# Altium project flyingpi.PrjPcb
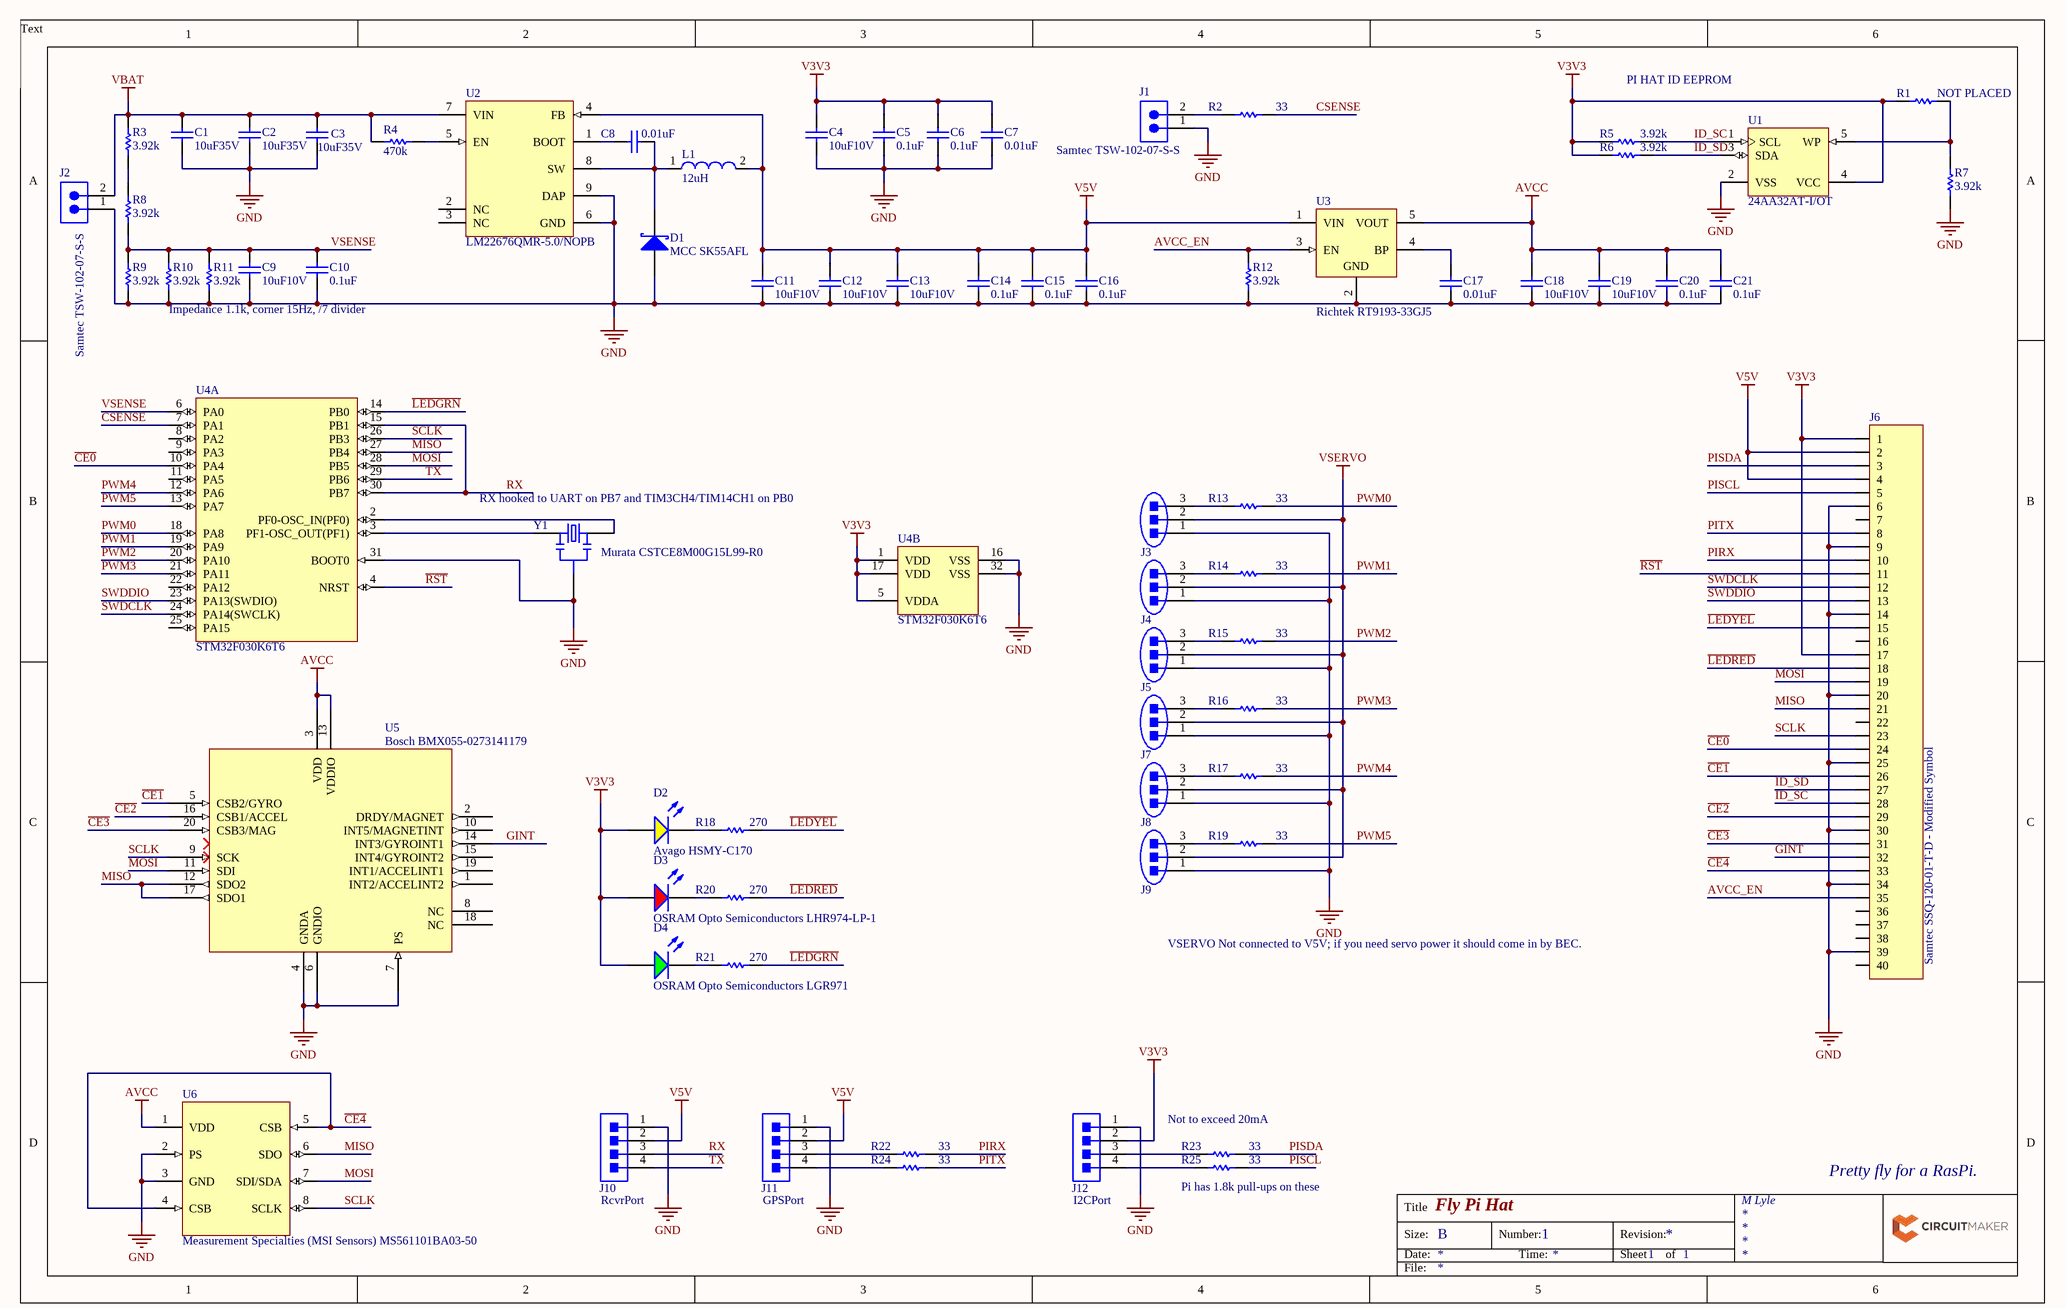
[diagram p0: flyingpi.SchDoc]
1 sheet, 70 parts. Net scope: global (net labels, ports and power ports of the same name join across sheets).

## Sheet flyingpi.SchDoc: Fly Pi Hat
size B; CompanyName: M Lyle; DrawnBy: M Lyle; Engineer: M Lyle; Organization: M Lyle; DocumentNumber: 1; SheetNumber: 1; SheetTotal: 1; PageSetup: Record=PageOptions|CenterHorizontal=True|CenterVertical=True|PrintScale=1.10|XCorrection=1.00|YCorrection=1.00|PrintKind=1|BorderSize=5000000|LeftOffset=0|BottomOffset=0|Orientation=2|PaperLength=4318|PaperWidth=2794|Scale=100|PaperSource=7|PrintQuality=-3|MediaType=1|DitherType=10|PrintScaleMode=1|PaperKind=US B (11 x 17 in)|PaperIndex=262

### Parts
C1  10uF35V  [PCB-4097432-1]
C2  10uF35V  [PCB-4097432-1]
C3  10uF35V  [PCB-4097432-1]
C4  10uF10V  [PCB-11286000-1]
C5  0.1uF  [CAPC1608X90X35LL10T15]
C6  0.1uF  [CAPC1608X90X35LL10T15]
C7  0.01uF  [0603C]
C8  0.01uF  [0603C]
C9  10uF10V  [PCB-11286000-1]
C10  0.1uF  [CAPC1608X90X35LL10T15]
C11  10uF10V  [PCB-11286000-1]
C12  10uF10V  [PCB-11286000-1]
C13  10uF10V  [PCB-11286000-1]
C14  0.1uF  [CAPC1608X90X35LL10T15]
C15  0.1uF  [CAPC1608X90X35LL10T15]
C16  0.1uF  [CAPC1608X90X35LL10T15]
C17  0.01uF  [0603C]
C18  10uF10V  [PCB-11286000-1]
C19  10uF10V  [PCB-11286000-1]
C20  0.1uF  [CAPC1608X90X35LL10T15]
C21  0.1uF  [CAPC1608X90X35LL10T15]
D1  MCC SK55AFL  [SODFL500X120-2N]
D2  Avago HSMY-C170  [SMD_LED0805]
D3  OSRAM Opto Semiconductors LHR974-LP-1  [LED0805]
D4  OSRAM Opto Semiconductors LGR971  [LED0805]
J1  Samtec TSW-102-07-S-S  [HDR102]
J2  Samtec TSW-102-07-S-S  [HDR102]
J3  TE Connectivity (Tyco Electronics) 5-146280-3  [HDR1x3_100mil]  (value not drawn)
J4  TE Connectivity (Tyco Electronics) 5-146280-3  [HDR1x3_100mil]  (value not drawn)
J5  TE Connectivity (Tyco Electronics) 5-146280-3  [HDR1x3_100mil]  (value not drawn)
J6  Samtec SSQ-120-01-T-D - Modified Symbol  [PCB-677180-1]
J7  TE Connectivity (Tyco Electronics) 5-146280-3  [HDR1x3_100mil]  (value not drawn)
J8  TE Connectivity (Tyco Electronics) 5-146280-3  [HDR1x3_100mil]  (value not drawn)
J9  TE Connectivity (Tyco Electronics) 5-146280-3  [HDR1x3_100mil]  (value not drawn)
J10  TE Connectivity (Tyco Electronics) 3-644456-4  [PCB-640283-1]  (value not drawn)
J11  TE Connectivity (Tyco Electronics) 3-644456-4  [PCB-640283-1]  (value not drawn)
J12  TE Connectivity (Tyco Electronics) 3-644456-4  [PCB-640283-1]  (value not drawn)
L1  12uH  [WE-PD-L]
R1  NOT PLACED  [RESC1609X50X30LL10T20]
R2  33  [RESC1609X50X30LL10T20]
R3  3.92k  [RESC1609X50X30LL10T20]
R4  470k  [RESC1608X55X30LL15T15]
R5  3.92k  [RESC1609X50X30LL10T20]
R6  3.92k  [RESC1609X50X30LL10T20]
R7  3.92k  [RESC1609X50X30LL10T20]
R8  3.92k  [RESC1609X50X30LL10T20]
R9  3.92k  [RESC1609X50X30LL10T20]
R10  3.92k  [RESC1609X50X30LL10T20]
R11  3.92k  [RESC1609X50X30LL10T20]
R12  3.92k  [RESC1609X50X30LL10T20]
R13  33  [RESC1609X50X30LL10T20]
R14  33  [RESC1609X50X30LL10T20]
R15  33  [RESC1609X50X30LL10T20]
R16  33  [RESC1609X50X30LL10T20]
R17  33  [RESC1609X50X30LL10T20]
R18  270  [RESC1609X50X30LL10T20]
R19  33  [RESC1609X50X30LL10T20]
R20  270  [RESC1609X50X30LL10T20]
R21  270  [RESC1609X50X30LL10T20]
R22  33  [RESC1609X50X30LL10T20]
R23  33  [RESC1609X50X30LL10T20]
R24  33  [RESC1609X50X30LL10T20]
R25  33  [RESC1609X50X30LL10T20]
U1  24AA32AT-I/OT  [SOT-23-OT5_L]
U2  LM22676QMR-5.0/NOPB  [MRA08B_M]
U3  Richtek RT9193-33GJ5  [PCB-1508243-1]
U4  STM32F030K6T6  [STM-LQFP32_N]  (parts A,B of 2)
U5  Bosch BMX055-0273141179  [LGA20]
U6  Measurement Specialties (MSI Sensors) MS561101BA03-50  [PCB-13001525-1]
Y1  Murata CSTCE8M00G15L99-R0  [X3-SMD-3.6X1.3X0.8MM]

### Nets
AVCC: C18.2 C19.2 C20.2 C21.2 U3.5(VOUT) U5.3(VDD) U5.13(VDDIO) U6.1(VDD)
GND: C1.1 C2.1 C3.1 C4.1 C5.1 C6.1 C7.1 C9.1 C10.1 C11.1 C12.1 C13.1 C14.1 C15.1 C16.1 C17.1 C18.1 C19.1 C20.1 C21.1 D1.1(A) J1.1 J2.1 J3.1 J4.1 J5.1 J6.6 J6.9 J6.14 J6.20 J6.25 J6.30 J6.34 J6.39 J7.1 J8.1 J9.1 J10.1 J11.1 J12.1 R7.2 R9.1 R10.1 R11.1 R12.2 U1.2(VSS) U2.6(GND) U2.9(DAP) U3.2(GND) U4.16(VSS) U4.31(BOOT0) U4.32(VSS) U5.4(GNDA) U5.6(GNDIO) U5.7(PS) U6.2(PS) U6.3(GND) Y1.2
V3V3: C4.2 C5.2 C6.2 C7.2 D2.2(A) D3.2(A) D4.2(A) J6.1 J6.17 J12.2 R1.1 R5.2 R6.2 U1.4(VCC) U4.1(VDD) U4.5(VDDA) U4.17(VDD)
V5V: C11.2 C12.2 C13.2 C14.2 C15.2 C16.2 J6.2 J6.4 J10.2 J11.2 L1.2 U2.4(FB) U3.1(VIN)
VBAT: C1.2 C2.2 C3.2 J2.2 R3.2 R4.1 U2.7(VIN)
VSERVO: J3.2 J4.2 J5.2 J7.2 J8.2 J9.2
AVCC_EN: J6.35 R12.1 U3.3(EN)
~{CE0}: J6.24 U4.10(PA4)
~{CE1}: J6.26 U5.5(CSB2/GYRO)
~{CE2}: J6.29 U5.16(CSB1/ACCEL)
~{CE3}: J6.31 U5.20(CSB3/MAG)
~{CE4}: J6.33 U6.4(CSB) U6.5(CSB)
CSENSE: R2.1 U4.7(PA1)
GINT: J6.32 U5.14(INT3/GYROINT1)
ID_SC: J6.28 R5.1 U1.1(SCL)
ID_SD: J6.27 R6.1 U1.3(SDA)
~{LEDGRN}: R21.1 U4.14(PB0)
~{LEDRED}: J6.18 R20.1
~{LEDYEL}: J6.15 R18.1
MISO: J6.21 U4.27(PB4) U5.12(SDO2) U5.17(SDO1) U6.6(SDO)
MOSI: J6.19 U4.28(PB5) U5.11(SDI) U6.7(SDI/SDA)
PIRX: J6.10 R22.1
PISCL: J6.5 R25.1
PISDA: J6.3 R23.1
PITX: J6.8 R24.1
PWM0: R13.1 U4.18(PA8)
PWM1: R14.1 U4.19(PA9)
PWM2: R15.1 U4.20(PA10)
PWM3: R16.1 U4.21(PA11)
PWM4: R17.1 U4.12(PA6)
PWM5: R19.1 U4.13(PA7)
~{RST}: J6.11 U4.4(NRST)
RX: J10.3 U4.15(PB1) U4.30(PB7)
SCLK: J6.23 U4.26(PB3) U5.9(SCK) U6.8(SCLK)
SWDCLK: J6.12 U4.24(PA14(SWCLK))
SWDDIO: J6.13 U4.23(PA13(SWDIO))
TX: J10.4 U4.29(PB6)
VSENSE: C9.2 C10.2 R8.1 R9.2 R10.2 R11.2 U4.6(PA0)
NetC8_1: C8.1 U2.1(BOOT)
NetC8_2: C8.2 D1.2(K) L1.1 U2.8(SW)
NetC17_2: C17.2 U3.4(BP)
NetD2_1: D2.1(C) R18.2
NetD3_1: D3.1(C) R20.2
NetD4_1: D4.1(C) R21.2
NetJ1_2: J1.2 R2.2
NetJ3_3: J3.3 R13.2
NetJ4_3: J4.3 R14.2
NetJ5_3: J5.3 R15.2
NetJ7_3: J7.3 R16.2
NetJ8_3: J8.3 R17.2
NetJ9_3: J9.3 R19.2
NetJ11_3: J11.3 R22.2
NetJ11_4: J11.4 R24.2
NetJ12_3: J12.3 R23.2
NetJ12_4: J12.4 R25.2
NetR1_2: R1.2 R7.1 U1.5(WP)
NetR3_1: R3.1 R8.2
NetR4_2: R4.2 U2.5(EN)
NetU4_2: U4.2(PF0-OSC_IN(PF0)) Y1.3
NetU4_3: U4.3(PF1-OSC_OUT(PF1)) Y1.1

Not connected (* = marked no-connect by the designer): J6 7 16 22 36 37 38 40; U2 2(NC) 3(NC); U4 8(PA2) 9(PA3) 11(PA5) 22(PA12) 25(PA15); U5 1(INT2/ACCELINT2) 2(DRDY/MAGNET) 8(NC) 10(INT5/MAGNETINT) 15(INT4/GYROINT2) 18(NC) 19(INT1/ACCELINT1)

### Notes on the sheet
- Text
- PI HAT ID EEPROM
- Impedance 1.1k, corner 15Hz, /7 divider
- (near Y1) RX hooked to UART on PB7 and TIM3CH4/TIM14CH1 on PB0
- VSERVO Not connected to V5V; if you need servo power it should come in by BEC.
- Not to exceed 20mA
- (near R25) Pi has 1.8k pull-ups on these
- Pretty fly for a RasPi.
- (near J10) RcvrPort
- (near J11) GPSPort
- (near J12) I2CPort
- Title
- Size:
- Date:
- B
- Number:
- Time:
- Revision:
- Sheet
- of
- File:

### Library data of the parts
C1-C3 = C2012X5R1V106K085AC: CAP CER 10UF 35V 10% X5R 0805; Capacitance: 1e-05 F; Dielectric Material: Ceramic Multilayer; Lead-Free Status: Lead Free; Voltage Rating (DC): 35.0 V; Capacitance Tolerance: ±10%; Case/Package: 2012; Dielectric Characteristic: X5R; Octopart Url: https://octopart.com/c2012x5r1v106k085ac-tdk-28169086; OctopartID: adab650c5bb3726c; RoHS: Compliant; Size-Length: 0.002 m; Size-Thickness: 0.00085 m; Size-Width: 0.00125 m
C4 C9 C11-C13 C18 C19 = GRM188R61A106KE69D: Cap Ceramic 10uF 10V X5R 10% SMD 0603 85C Paper T/R; Capacitance: 1e-05 F; Case/Package (SI): 1608; Lead-Free Status: Lead Free; Voltage Rating (DC): 10.0 V; Capacitance Tolerance: ±10%; Dielectric Characteristic: X5R; Lifecycle Status: Active; Octopart Url: https://octopart.com/grm188r61a106ke69d-murata-22851381; OctopartID: ec9224c466c13355; RoHS: Compliant; Size-Length: 0.0016 m; Size-Thickness: 0.0008 m; Size-Width: 0.0008 m
C5 C6 C10 C14-C16 C20 C21 = CMP-132596-3: CAP CER 0.1UF 16V 10% X7R 0603; Capacitance: 1e-07 F; Case/Package (SI): 1608; Lead-Free Status: Lead Free; Voltage Rating (DC): 16.0 V; Capacitance Tolerance: ±10%; Dielectric Characteristic: X7R; Lifecycle Status: Active; Octopart Url: https://octopart.com/grm188r71c104ka01j-murata-5464383; OctopartID: 1f85d6dc5bdcc042; RoHS: Compliant; Size-Length: 0.0016 m; Size-Thickness: 0.0008 m; Size-Width: 0.0008 m
C7 C8 C17 = GRM188R71H103KA01D: 0603 10nF 50V ±10 % Tolerance X7R SMT Multilayer Ceramic Capacitor; Lead-Free Status: Lead Free; Capacitance: 10.0 nF; Case/Package (SI): 1608; Insulation Resistance: 10.0 GΩ; Capacitance Tolerance: ±10%; Voltage Rating (DC): 50.0 V; Lifecycle Status: Active; REACH SVHC Compliance: No SVHC; Case/Package: 0603, 1608; Dielectric Characteristic: X7R; Size-Height: 800 µm; RoHS: Compliant; Size-Thickness: 800 µm; Packaging: Cut Tape (CT); Mounting Style: Surface Mount; Number of Pins: 2; Dielectric Material: Ceramic; Size-Length: 1.60 mm; Octopart Url: http://octopart.com/grm188r71h103ka01d-murata-81373; Manufacturer Part Number: GRM188R71H103KA01D; OctopartID: 481e811550a597d9; Size-Width: 800 µm; Seller Landing  Url: https://octopart-clicks.com/click/track?country=US&ak=8157f166&sig=0b1b9e5&sid=1106&ppid=81373&vpid=15059236&ct=offers
D1 = SK55AFL-TP: Diode Schottky 50v 5a Do221ac; OctopartID: 87164cce30a458d1; Manufacturer Part Number: SK55AFL-TP; Octopart URL: http://octopart.com/sk55afl-tp-mcc-47354580
D2 = HSMY-C170: LED 589NM YELLOW DIFF 0805 SMD; Forward Voltage: 2.1 V; Wavelength: 5.89e-07 m; Luminous Intensity: 0.008 cd; Lead-Free Status: Lead Free; Viewing Angle: 170 °; Lens Type: Diffused; Power Dissipation: 0.052 W; Case/Package (SI): 2012; REACH SVHC Compliance: No SVHC; Packaging: Cut Tape (CT); Octopart Url: https://octopart.com/hsmy-c170-avago-550348; Peak Wavelength: 5.89e-07 m; Color: Yellow; OctopartID: 96665f64d6cc49a1; RoHS: Compliant; Case/Package: 0805; Lifecycle Status: Active; Number of Pins: 2
D3 = CMP-3212442-5: LED CHIPLED 645NM RED DIFF 0805; Octopart Url: https://octopart.com/lhr974-lp-1-osram-42982118; OctopartID: 43db885ebc5b9c1c
D4 = CMP-2502083-4: Osram Opto CHIPLED 0805 Series 0805 Green LED, 160; Color: Green; Octopart Url: https://octopart.com/lgr971-osram+opto-31094655; OctopartID: 2d65e5b57f7cf2a2; RoHS: Compliant
J1 J2 = CMP-4501201-2: CONN HEADER 2POS .100" SGL GOLD; Gender: Male; Lead-Free Status: Lead Free; Number of Contacts: 2; Pin Pitch: 0.00254 m; Contact Material: Phosphor Bronze; Contact Plating: Gold; Housing Color: Black; Housing Material: Plastic; Mounting Style: Through Hole; Number of Positions: 2; Number of Rows: 1; Octopart Url: https://octopart.com/tsw-102-07-s-s-samtec-272397; OctopartID: 2036e9382d5dfff1; RoHS: Compliant; Size-Height: 0.00254 m; Size-Length: 0.00508 m; Size-Width: 0.00254 m
J3-J5 J7-J9 = CMP-663837-8: CONN HEADR BRKWAY .100 3POS STR; ELV Compliant: Compliant; Gender: Male; Lead-Free Status: Lead Free; Number of Contacts: 3; Contact Material: Copper Alloy; Flammability Rating: UL 94 V-0; Housing Color: Black; Lifecycle Status: Active; Mounting Style: PCB; Octopart Url: https://octopart.com/5-146280-3-te+connectivity+%2F+amp-39439323; OctopartID: dd271674339a02e0; Orientation: Vertical; RoHS: Compliant
J6 = CMP-677180-3: CONN RCPT .100" 40POS DUAL TIN; Lead-Free Status: Lead Free; Number of Contacts: 40; Pin Pitch: 0.00254 m; Contact Material: Phosphor Bronze; Contact Plating: Tin; Housing Color: Black; Housing Material: Plastic; Mounting Style: Through Hole; Number of Positions: 40; Number of Rows: 2; Octopart Url: https://octopart.com/ssq-120-01-t-d-samtec-294787; OctopartID: 1bafd2a1414ac468; Packaging: Tube; RoHS: Compliant; Size-Height: 0.00851 m; Size-Length: 0.05131 m; Size-Width: 0.00495 m
J10-J12 = CMP-640283-8: CONN HEADER VERT 4POS .100 TIN; Octopart Url: https://octopart.com/3-644456-4-te+connectivity+%2F+waldom-52613137; OctopartID: 7a2db0058f5aa5ea
L1 = 744771112: SMD-Shielded Power Inductor WE-PD, L = 12.0 µH; Inductance: 1.2e-05 H; Resistance: 0.023 Ω; Resonant Frequency: 19700000.0 Hz; Octopart Url: https://octopart.com/744771112-w%C3%BCrth+elektronik-19122167; OctopartID: 8c43446a6ed25384; Packaging: Cut Tape (CT); REACH SVHC Compliance: No SVHC; RoHS: Compliant; Self Resonant Frequency: 19700000.0 Hz
R1 R3 R5-R12 = CMP-1857412-2: RES SMD 3.92K OHM 1% 1/10W 0603; Lead-Free Status: Lead Free; Power Rating: 0.1 W; Resistance: 3920.0 Ω; Temperature Coefficient: 100.0 ppm/°C; Voltage Rating (DC): 75.0 V; Case/Package: 0603; Mounting Style: Surface Mount; Number of Pins: 2; Octopart Url: https://octopart.com/crcw06033k92fkea-vishay-39824544; OctopartID: 86014d540fc759c6; REACH SVHC Compliance: No SVHC; Resistance Tolerance: ±1%; RoHS: Compliant; Size-Height: 0.00045 m; Size-Length: 0.00155 m; Size-Width: 0.00085 m
R2 R13-R17 R19 R22-R25 = CMP-3902170-2: RES SMD 33 OHM 1% 1/10W 0603; Lead-Free Status: Lead Free; Power Rating: 0.1 W; Resistance: 33.0 Ω; Voltage Rating (DC): 75.0 V; Case/Package: 0603; Mounting Style: Surface Mount; Number of Pins: 2; Octopart Url: https://octopart.com/crcw060333r0fkea-vishay-39800560; OctopartID: 9dd8568df64e421f; REACH SVHC Compliance: No SVHC; Resistance Tolerance: ±1%; RoHS: Compliant; Size-Height: 0.00045 m; Size-Length: 0.00155 m; Size-Width: 0.00085 m
R4 = ERJ-3EKF4703V: Res Thick Film 0603 470K Ohm 1% 0.1W(1/10W) ±100ppm/C Molded SMD Automotive Punched T/R; Lead-Free Status: Lead Free; Resistance: 470000.0 Ω; Voltage Rating (DC): 75.0 V; Case/Package: 0603; Lifecycle Status: Not Listed by Manufacturer; Mounting Style: Surface Mount; Number of Pins: 2; Octopart Url: https://octopart.com/erj-3ekf4703v-panasonic-9251211; OctopartID: b4077d80b8ea6bc0; Power Rating: 0.1 W; REACH SVHC Compliance: No SVHC; Resistance Tolerance: ±1%; RoHS: Compliant
R18 R20 R21 = CMP-1856060-2: RES SMD 270 OHM 5% 1/10W 0603; Lead-Free Status: Lead Free; Power Rating: 0.1 W; Resistance: 270.0 Ω; Temperature Coefficient: 200.0 ppm/°C; Voltage Rating (DC): 75.0 V; Case/Package: 0603; Mounting Style: Surface Mount; Number of Pins: 2; Octopart Url: https://octopart.com/crcw0603270rjnea-vishay-39784736; OctopartID: 5ba390f66fe58464; Packaging: Cut Tape (CT); Resistance Tolerance: ±5%; RoHS: Compliant; Size-Height: 0.00045 m; Size-Length: 0.00155 m; Size-Width: 0.00085 m
U1 = CMP-977572-2: 32Kbit, 400kHz, 1.7V, I2C Serial EEPROM, 5-Pin SOT-23, Industrial Temperature, Tape and Reel; Clock Speed: 400000.0 Hz; Lead-Free Status: Lead Free; Memory Size: 4000 B; Frequency: 400000.0 Hz; Lifecycle Status: Active; Mounting Style: Surface Mount; Number of Pins: 5; Octopart Url: https://octopart.com/24aa32at-i%2Fot-microchip-17751700; OctopartID: c0a708a33b551f60; Packaging: Cut Tape (CT); RoHS: Compliant
U2 = LM22676QMR-5.0/NOPB: 3A SIMPLE SWITCHER®, Step-Down Voltage Regulator with Precision Enable, 5V Output, Automotive Grade, 8-pin PSOP, 95 Rail; Lead-Free Status: Lead Free; Number of Regulated Outputs: 1; Quiescent Current: 0.0034 A; Switching Frequency: 1000000.0 Hz; Topology: Buck; Lifecycle Status: Active; Octopart Url: https://octopart.com/lm22676qmr-5.0%2Fnopb-texas+instruments-24812631; OctopartID: 76d9bea9cfe8a91e; RoHS: Compliant
U3 = RT9193-33GJ5: IC REG LDO 3.3V 0.3A TSOT23-5; Octopart Url: https://octopart.com/rt9193-33gj5-richtek-19718811; OctopartID: 7a67b241bd9aa5a0
U4 = STM32F030K6T6: ARM Cortex-M0 32-bit MCU, 32 KB Flash, 4 KB Internal RAM, 26 I/Os, 32-pin LQFP, -40 to 85 degC, Tray; RAM Memory Size: 4096 B; Clock Speed: 48000000.0 Hz; Lead-Free Status: Lead Free; Number of Pins: 32; Packaging: Cut Tape (CT); REACH SVHC Compliance: No SVHC; Mounting Style: Surface Mount; OctopartID: 87924f52f9ac5855; RoHS: Compliant; Lifecycle Status: Active; Octopart Url: https://octopart.com/stm32f030k6t6-stmicroelectronics-30038872
U5 = BMX055-0273141179: BMX055 Sensor 9-Axis ±2/±4/±8/±16 g 3 V Small Versatile Sensor Module - LGA-20; Lead-Free Status: Lead Free; Manufacturer Part Number: BMX055-0273141179; OctopartID: ae7c646ba71f71bb; RoHS: Compliant; Octopart URL: http://octopart.com/bmx055-0273141179-bosch-52243461
U6 = MS561101BA03-50: MEASUREMENT SPECIALTIES   MS561101BA03-50   SENSOR, BAROMETRIC, 0.01-1.2BAR, QFN-8; Supply Current: 1.25e-05 A; Number of Pins: 8; Octopart Url: https://octopart.com/ms561101ba03-50-measurement+specialties-46439468; OctopartID: bbb0707e02fa6477; RoHS: Compliant
Y1 = CSTCE8M00G15L99-R0: Ceramic Resonator 8MHz Ø¢±0.1% (Tol) Ø¢±0.08% (Stability) 33pF 40Ohm 3-Pin CSMD T/R; Frequency: 8000000.0 Hz; Lead-Free Status: Lead Free; Manufacturer Part Number: CSTCE8M00G15L99-R0; Octopart Url: http://octopart.com/cstce8m00g15l99-r0-murata-17751576; OctopartID: d7031f072c7d08c4; RoHS: Compliant; Seller Landing  Url: https://octopart-clicks.com/click/track?country=US&ak=8157f166&sig=0731a42&sid=459&ppid=17751576&vpid=216077750&ct=offers